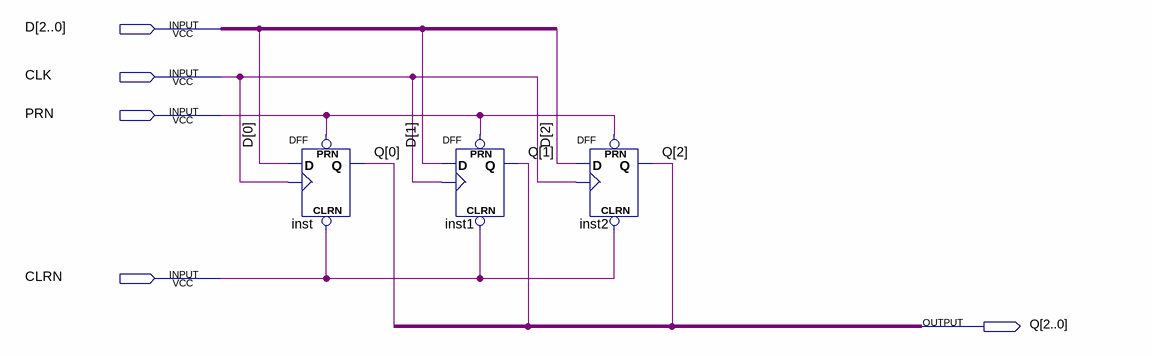
[diagram p0: schematic sheet]
// Quartus schematic d_flip_flop_3bit.bdf as structural Verilog: 3 symbols, 5 pins
module d_flip_flop_3bit (
  input  [2:0] D,
  input  CLK,
  input  PRN,
  input  CLRN,
  output [2:0] Q
);

  DFF inst (.CLRN(CLRN), .CLK(CLK), .D(D[0]), .PRN(PRN), .Q(Q[0]));
  DFF inst1 (.CLRN(CLRN), .CLK(CLK), .D(D[1]), .PRN(PRN), .Q(Q[1]));
  DFF inst2 (.CLRN(CLRN), .CLK(CLK), .D(D[2]), .PRN(PRN), .Q(Q[2]));
endmodule
